# Altium project mmWave_PCB.PrjPcb (part 1 of 2)
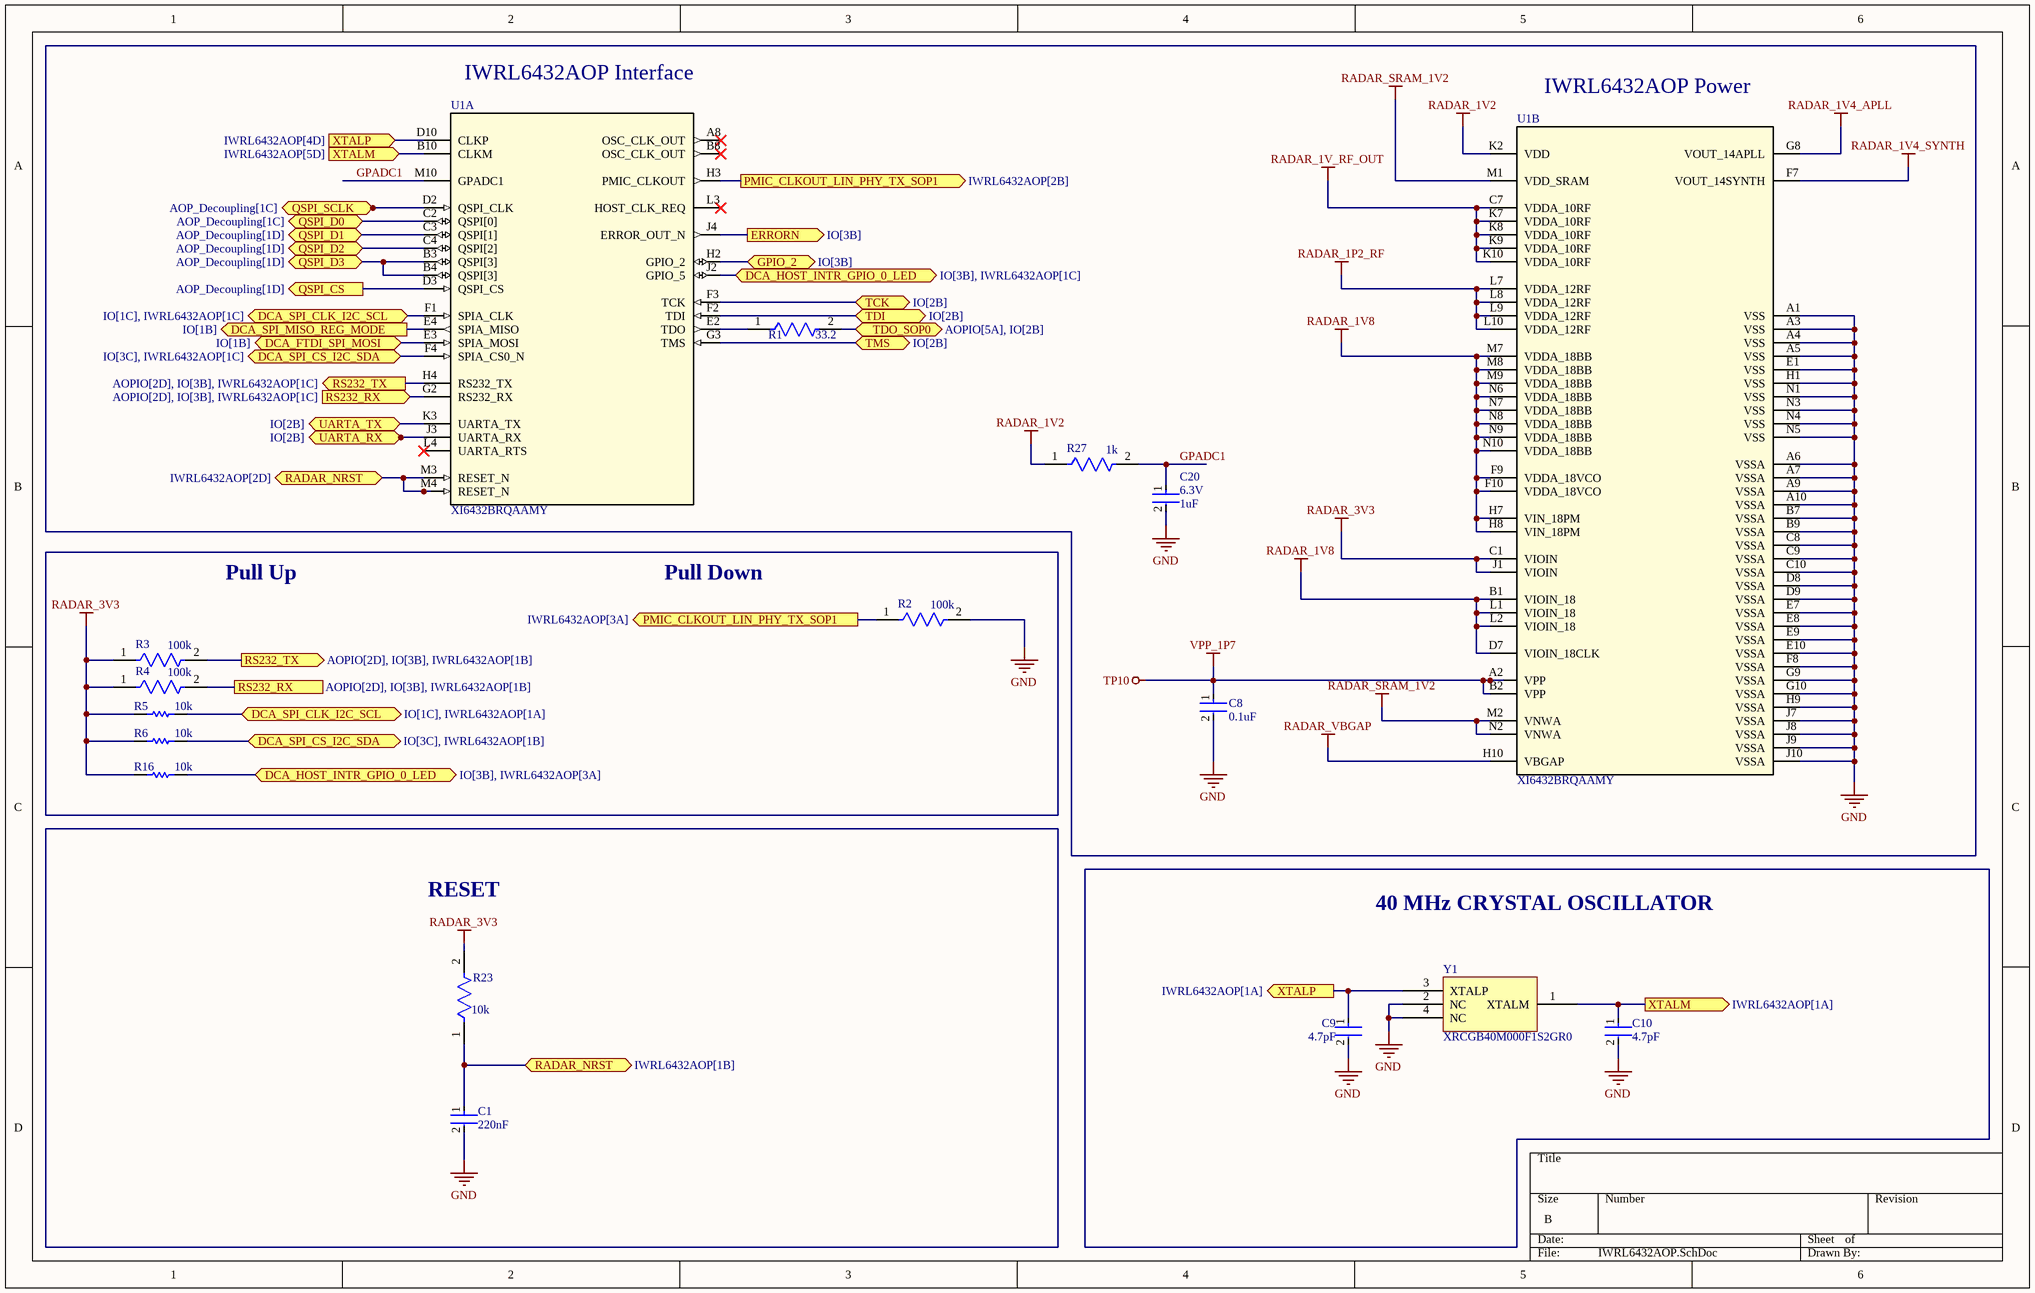
[diagram p0: IWRL6432AOP.SchDoc]
5 sheets, 112 parts. Net scope: flat (ports and power ports of the same name join across sheets).
Board file: AOP6432.PcbDoc
Sheets:
  IWRL6432AOP.SchDoc
  DC_Regulator.SchDoc
  AOP_Decoupling.SchDoc
  AOPIO.SchDoc
  IO.SchDoc

## Sheet IWRL6432AOP.SchDoc
size B; SheetNumber: 1; SheetTotal: 5

### Parts
C1  Capacitance: 220nF  [FP-CL549-IPC_C]  (hidden comment: CL05B224KO5NNNC)
C8  0.1uF  [FP-C0402-BB-MFG]
C9  Capacitance: 4.7pF  [FP-GJM155-0_05-IPC_C]  (hidden comment: GJM1555C1H4R7BB01D)
C10  Capacitance: 4.7pF  [FP-GJM155-0_05-IPC_C]  (hidden comment: GJM1555C1H4R7BB01D)
C20  Capacitance: 1uF  Voltage Rating (DC): 6.3V  [FP-GRM155-0_05-IPC_C]  (hidden comment: GRM155C80J105KA12D)
R1  Resistance: 33.2  [FP-RT0402-0_35-MFG]  (hidden comment: RT0402FRE0733R2L)
R2  Resistance: 100k  [FP-CRCW0402-C-e3-MFG]  (hidden comment: CRCW0402100KFKEDC)
R3  Resistance: 100k  [FP-CRCW0402-C-e3-MFG]  (hidden comment: CRCW0402100KFKEDC)
R4  Resistance: 100k  [FP-CRCW0402-C-e3-MFG]  (hidden comment: CRCW0402100KFKEDC)
R5  10k  [RESC1005X40X25LL05T10]
R6  10k  [RESC1005X40X25LL05T10]
R16  10k  [RESC1005X40X25LL05T10]
R23  Resistance: 10k  [FP-ERJ1R-MFG]  (hidden comment: ERJ-1RHD1002C)
R27  Resistance: 1k  [FP-RC0402-0_4-IPC_A]  (hidden comment: RC0402FR-071KL)
U1  XI6432BRQAAMY  [AMY0101A-MFG]  (parts A,B of 2)
Y1  XRCGB40M000F1S2GR0  [XRCGB40M000F1S2GR0]

### Ports
DCA_FTDI_SPI_MOSI (bidir, see IO[1B]), DCA_HOST_INTR_GPIO_0_LED (bidir, see IO[3B], IWRL6432AOP[1C]), DCA_HOST_INTR_GPIO_0_LED (bidir, see IO[3B], IWRL6432AOP[3A]), DCA_SPI_CLK_I2C_SCL (bidir, see IO[1C], IWRL6432AOP[1A]), DCA_SPI_CLK_I2C_SCL (bidir, see IO[1C], IWRL6432AOP[1C]), DCA_SPI_CS_I2C_SDA (bidir, see IO[3C], IWRL6432AOP[1B]), DCA_SPI_CS_I2C_SDA (bidir, see IO[3C], IWRL6432AOP[1C]), DCA_SPI_MISO_REG_MODE (out, see IO[1B]), ERRORN (out, see IO[3B]), GPIO_2 (bidir, see IO[3B]), PMIC_CLKOUT_LIN_PHY_TX_SOP1 (out, see IWRL6432AOP[2B]), PMIC_CLKOUT_LIN_PHY_TX_SOP1 (out, see IWRL6432AOP[3A]), QSPI_CS (out, see AOP_Decoupling[1D]), QSPI_D0 (bidir, see AOP_Decoupling[1C]), QSPI_D1 (bidir, see AOP_Decoupling[1D]), QSPI_D2 (bidir, see AOP_Decoupling[1D]), QSPI_D3 (bidir, see AOP_Decoupling[1D]), QSPI_SCLK (bidir, see AOP_Decoupling[1C]), RADAR_NRST (bidir, see IWRL6432AOP[1B]), RADAR_NRST (bidir, see IWRL6432AOP[2D]), RS232_RX (in, see AOPIO[2D], IO[3B], IWRL6432AOP[1C]), RS232_RX (see AOPIO[2D], IO[3B], IWRL6432AOP[1B]), RS232_TX (out, see AOPIO[2D], IO[3B], IWRL6432AOP[1B]), RS232_TX (out, see AOPIO[2D], IO[3B], IWRL6432AOP[1C]), TCK (bidir, see IO[2B]), TDI (bidir, see IO[2B]), TDO_SOP0 (bidir, see AOPIO[5A], IO[2B]), TMS (bidir, see IO[2B]), UARTA_RX (bidir, see IO[2B]), UARTA_TX (bidir, see IO[2B]), XTALM (in, see IWRL6432AOP[5D]), XTALM (out, see IWRL6432AOP[1A]), XTALP (in, see IWRL6432AOP[4D]), XTALP (out, see IWRL6432AOP[1A])

### Nets
GND: C1.2 C8.2 C9.2 C10.2 C20.2 R2.2 U1.A1(VSS) U1.A3(VSS) U1.A4(VSS) U1.A5(VSS) U1.A6(VSSA) U1.A7(VSSA) U1.A9(VSSA) U1.A10(VSSA) U1.B7(VSSA) U1.B9(VSSA) U1.C8(VSSA) U1.C9(VSSA) U1.C10(VSSA) U1.D8(VSSA) U1.D9(VSSA) U1.E1(VSS) U1.E7(VSSA) U1.E8(VSSA) U1.E9(VSSA) U1.E10(VSSA) U1.F8(VSSA) U1.G9(VSSA) U1.G10(VSSA) U1.H1(VSS) U1.H9(VSSA) U1.J7(VSSA) U1.J8(VSSA) U1.J9(VSSA) U1.J10(VSSA) U1.N1(VSS) U1.N3(VSS) U1.N4(VSS) U1.N5(VSS) Y1.2(NC) Y1.4(NC)
RADAR_1P2_RF: U1.L7(VDDA_12RF) U1.L8(VDDA_12RF) U1.L9(VDDA_12RF) U1.L10(VDDA_12RF)
RADAR_1V2: R27.1 U1.K2(VDD)
RADAR_1V4_APLL: U1.G8(VOUT_14APLL)
RADAR_1V4_SYNTH: U1.F7(VOUT_14SYNTH)
RADAR_1V8: U1.B1(VIOIN_18) U1.D7(VIOIN_18CLK) U1.F9(VDDA_18VCO) U1.F10(VDDA_18VCO) U1.H7(VIN_18PM) U1.H8(VIN_18PM) U1.L1(VIOIN_18) U1.L2(VIOIN_18) U1.M7(VDDA_18BB) U1.M8(VDDA_18BB) U1.M9(VDDA_18BB) U1.N6(VDDA_18BB) U1.N7(VDDA_18BB) U1.N8(VDDA_18BB) U1.N9(VDDA_18BB) U1.N10(VDDA_18BB)
RADAR_1V_RF_OUT: U1.C7(VDDA_10RF) U1.K7(VDDA_10RF) U1.K8(VDDA_10RF) U1.K9(VDDA_10RF) U1.K10(VDDA_10RF)
RADAR_3V3: R3.1 R4.1 R5.1 R6.1 R16.1 R23.2 U1.C1(VIOIN) U1.J1(VIOIN)  [project net FT230_VCCIO]
RADAR_SRAM_1V2: U1.M1(VDD_SRAM) U1.M2(VNWA) U1.N2(VNWA)
RADAR_VBGAP: U1.H10(VBGAP)
TP10: C8.1 U1.A2(VPP) U1.B2(VPP)  [also labelled VPP_1P7]
GPADC1: C20.1 R27.2 U1.M10(GPADC1)
NetC1_1: C1.1 R23.1 U1.M3(RESET_N) U1.M4(RESET_N) ; port RADAR_NRST
NetC9_1: C9.1 U1.D10(CLKP) Y1.3(XTALP) ; port XTALP
NetC10_1: C10.1 U1.B10(CLKM) Y1.1(XTALM) ; port XTALM
NetJ1_3: U1.F3(TCK) ; port TCK
NetJ1_5: U1.F2(TDI) ; port TDI
NetJ1_7: R1.2 ; port TDO_SOP0
NetJ1_8: R3.2 U1.H4(RS232_TX) ; port RS232_TX
NetJ1_10: R4.2 U1.G2(RS232_RX) ; port RS232_RX
NetJ1_11: U1.K3(UARTA_TX) ; port UARTA_TX
NetJ1_12: U1.J4(ERROR_OUT_N) ; port ERRORN
NetJ1_13: U1.J3(UARTA_RX) ; port UARTA_RX
NetJ1_15: U1.G3(TMS) ; port TMS
NetJ1_16: U1.H2(GPIO_2) ; port GPIO_2
NetJ1_18: R16.2 U1.J2(GPIO_5) ; port DCA_HOST_INTR_GPIO_0_LED
NetJ1_19: U1.E3(SPIA_MOSI) ; port DCA_FTDI_SPI_MOSI
NetJ1_21: U1.E4(SPIA_MISO) ; port DCA_SPI_MISO_REG_MODE
NetJ1_23: R5.2 U1.F1(SPIA_CLK) ; port DCA_SPI_CLK_I2C_SCL
NetJ1_24: R6.2 U1.F4(SPIA_CS0_N) ; port DCA_SPI_CS_I2C_SDA
NetR1_1: R1.1 U1.E2(TDO)
NetR2_1: R2.1 U1.H3(PMIC_CLKOUT) ; port PMIC_CLKOUT_LIN_PHY_TX_SOP1
NetR7_1: U1.D3(QSPI_CS) ; port QSPI_CS
NetR8_1: U1.B3(QSPI[3]) U1.B4(QSPI[3]) ; port QSPI_D3
NetR9_1: U1.C4(QSPI[2]) ; port QSPI_D2
NetR10_1: U1.D2(QSPI_CLK) ; port QSPI_SCLK
NetR11_1: U1.C2(QSPI[0]) ; port QSPI_D0
NetR12_1: U1.C3(QSPI[1]) ; port QSPI_D1

Not connected (* = marked no-connect by the designer): U1 A8(OSC_CLK_OUT)* B8(OSC_CLK_OUT)* L3(HOST_CLK_REQ)* L4(UARTA_RTS)*

### Notes on the sheet
- IWRL6432AOP Interface
- IWRL6432AOP Power
- Pull Up
- Pull Down
- RESET
- 40 MHz CRYSTAL OSCILLATOR

### Library data of the parts
C1 = CMP-13271-002972-1: Cap Ceramic 220nF 16V X7R ±10% SMD 0402 +125°C Paper T/R; Length: 1mm; Case Code (Metric): 1005; Dielectric: X7R; Thickness: 0.022inch; Packaging: Tape and Reel; Width: 0.02inch; Voltage Rating: 16V; Max Operating Temperature: 125°C; Tolerance: 10%; Depth: 0.5mm; Radiation Hardening: No; Case Code (Imperial): 0402; Height: 0.5mm; Package Quantity: 1; Mount: Surface Mount; Case/Package: 0402; Min Operating Temperature: -55°C
C8 = CMP-2008-03086-2: CAP CER 0.1UF 10V X7R 0402; Manufacturer Part Number: C0402C104K8RACTU; Manufacturer: Kemet; Capacitance: 0.10 μF; Tolerance: 0.1; Temperature Coefficient: 15%; Value: 0.10 μF; Material: Ceramic; Automotive: No; Temperature Range High: +125°C; Octopart: https://octopart.com/c0402c104k8ractu-kemet-106349; ComponentLink2Description: Datasheet; ComponentLink2URL: https://content.kemet.com/datasheets/KEM_C1002_X7R_SMD.pdf; Temperature: -55°C to +125°C; RoHS: TRUE; Temperature Range Low: -55°C; Temperature Characteristic: X7R; Lead Free: Yes; Height: 0.55mm; Voltage Rating: 10 V; Category: Cap; Device Class L3: Ceramic Capacitors; Digikey Description: CAP CER 0.1UF 10V X7R 0402; Package: C0402-BB; Device Class L1: Passive Components; Ipc Land Pattern Name: CAPC10050X50; Mouser Description: Multilayer Ceramic Capacitors MLCC - SMD/SMT 10volts 0.1uF X7R 10%; Device Class L2: Capacitors
C9 C10 = CMP-2008-03751-2: Multi-Layer Ceramic Capacitor 4.7pF C0G  ±0.1pF 0402 Paper T/R; Voltage Rating (DC): 50V; Max Operating Temperature: 125°C; Radiation Hardening: No; Thickness: 0.022inch; Depth: 0.5mm; Termination: SMD/SMT; Min Operating Temperature: -55°C; Case Code (Imperial): 0402; Voltage Rating: 50V; Dielectric: C0G; Length: 1mm; Package Quantity: 10000; Case/Package: 0402; Width: 0.5mm; Case Code (Metric): 1005; Packaging: Tape and Reel; Height: 0.5mm; Mount: Surface Mount
C20 = CMP-06035-011876-1: Chip Multilayer Ceramic Capacitors for General Purpose, 0402, 1.0uF, X6S, 22%, 10%, 6.3V; Dielectric: X6S; Width: 500um; Length: 1mm; Thickness: 500um; Tolerance: 10%
R1 = CMP-2002-03033-3: NexarPartId: 1272564; Max Power Dissipation: 63mW; Voltage Rating: 50V; Temperature Coefficient: 50ppm/°C; Tolerance: 1%; Packaging: Tape & Reel (TR); Radiation Hardening: No; Military Standard: Not; Contact Plating: Tin; Case Code (Metric): 0402; Max Operating Temperature: 125°C; Height: 350µm; Lead Free: Lead Free; Case/Package: 0402; Width: 508µm; Length: 990.6µm; RoHS: Compliant; Number of Terminations: 2; Voltage Rating (DC): 50V; Min Operating Temperature: -55°C; Power Rating: 63mW; Depth: 500µm; Composition: Thin Film
R2-R4 = CMP-02407-010951-1: RES 100K OHM 1% 1/16W 0402; Temperature Coefficient: 100ppm/°C; Power Rating: 62.5mW; Lead Free: Lead Free; Length: 1mm; Tolerance: 1%; Resistor Type: Thick Film; Contact Plating: Tin; Case/Package: SMD/SMT; Min Operating Temperature: -55°C; RoHS Compliant: Yes; Termination: Wraparound; Max Operating Temperature: 155°C; Mount: Surface Mount
R5 R6 R16 = CMP-2002-07353-1: Part Number: RC0402FR-0710KL; Manufacturer: Yageo / Phycomp
R23 = CMP-2004-03441-2: RES SMD 10K OHM 0.5% 1/20W 0201; Temperature Coefficient: 50ppm/°C; Voltage Rating: 15V; Max Power Dissipation: 50mW; Termination: SMD/SMT; Military Standard: Not; Depth: 0.3mm; Series: ERJ; Lead Free: Lead Free; Packaging: Tape and Reel; Package Quantity: 15000; Max Operating Temperature: 125°C; Width: 0.3mm; Tolerance: 0.5%; Case Code (Imperial): 0201; Length: 0.6mm; Min Operating Temperature: -55°C; Resistor Type: Thick Film; Height: 0.23mm; Mount: Surface Mount; Power Rating: 50mW; Case/Package: 0201; Case Code (Metric): 0603; Number of Terminations: 2
R27 = CMP-2002-07472-3: RES 1K OHM 1% 1/16W 0402; Max Power Dissipation: 63mW; Voltage Rating (DC): 50V; Temperature Coefficient: 100ppm/°C; Power Rating: 62.5mW; Technology: THICK FILM; Size Code: 0402; Series: RC; Length: 1mm; Case/Package: 0402; Features: Moisture Resistant; Termination: SMD/SMT; Case Code (Metric): 1005; Reach SVHC Compliant: Yes; Number of Terminations: 2; Tolerance: 1%; Lead Free: Lead Free; Military Standard: Not; Resistor Type: Thick Film; Max Operating Temperature: 155°C; RoHS Compliant: Yes; Construction: Rectangular; Voltage Rating: 50V; Packaging: Tape and Reel; Height: 0.32mm; Number of Pins: 2; Resistance Tolerance: 1%; Case Code (Imperial): 0402; Depth: 0.5mm; Min Operating Temperature: -55°C; Width: 0.5mm
U1 = XI6432BRQAAMY: Single-chip low-power 57GHz to 63.5GHz industrial mmWave radar sensor with integrated antenna 101-FCCSP -40 to 105; Manufacturer_Name: Texas Instruments; TYPE: TYPE; RefDes: RefDes; Copyright: Copyright (C) 2026 Ultra Librarian. All rights reserved.; Manufacturer_Part_Number: XI6432BRQAAMY
Y1 = XRCGB40M000F1S2GR0: Crystal, 40MHZ, 8PF, SMD, 2MM X 1.6MM;; Manufacturer: Murata; Supplier: DigiKey; Supplier Part Number: 490-XRCGB40M000F1S2GR0CT-ND; Manufacturer Part Number: XRCGB40M000F1S2GR0; Category: Crystals; Stock: 3900; Pricing: 1=0.31, 10=0.273, 25=0.2584, 50=0.2478, 100=0.2376, 250=0.22472, 500=0.21544, 1000=0.20652 (USD); ComponentLink1URL: http://sigma.octopart.com:80/reach_statement/Murata-company-16.pdf?src-supplier=Compliance+Statements; ComponentLink1Description: http://sigma.octopart.com:80/reach_statement/Murata-company-16.pdf?src-supplier=Compliance+Statements

## Sheet DC_Regulator.SchDoc
size B; SheetNumber: 2; SheetTotal: 5
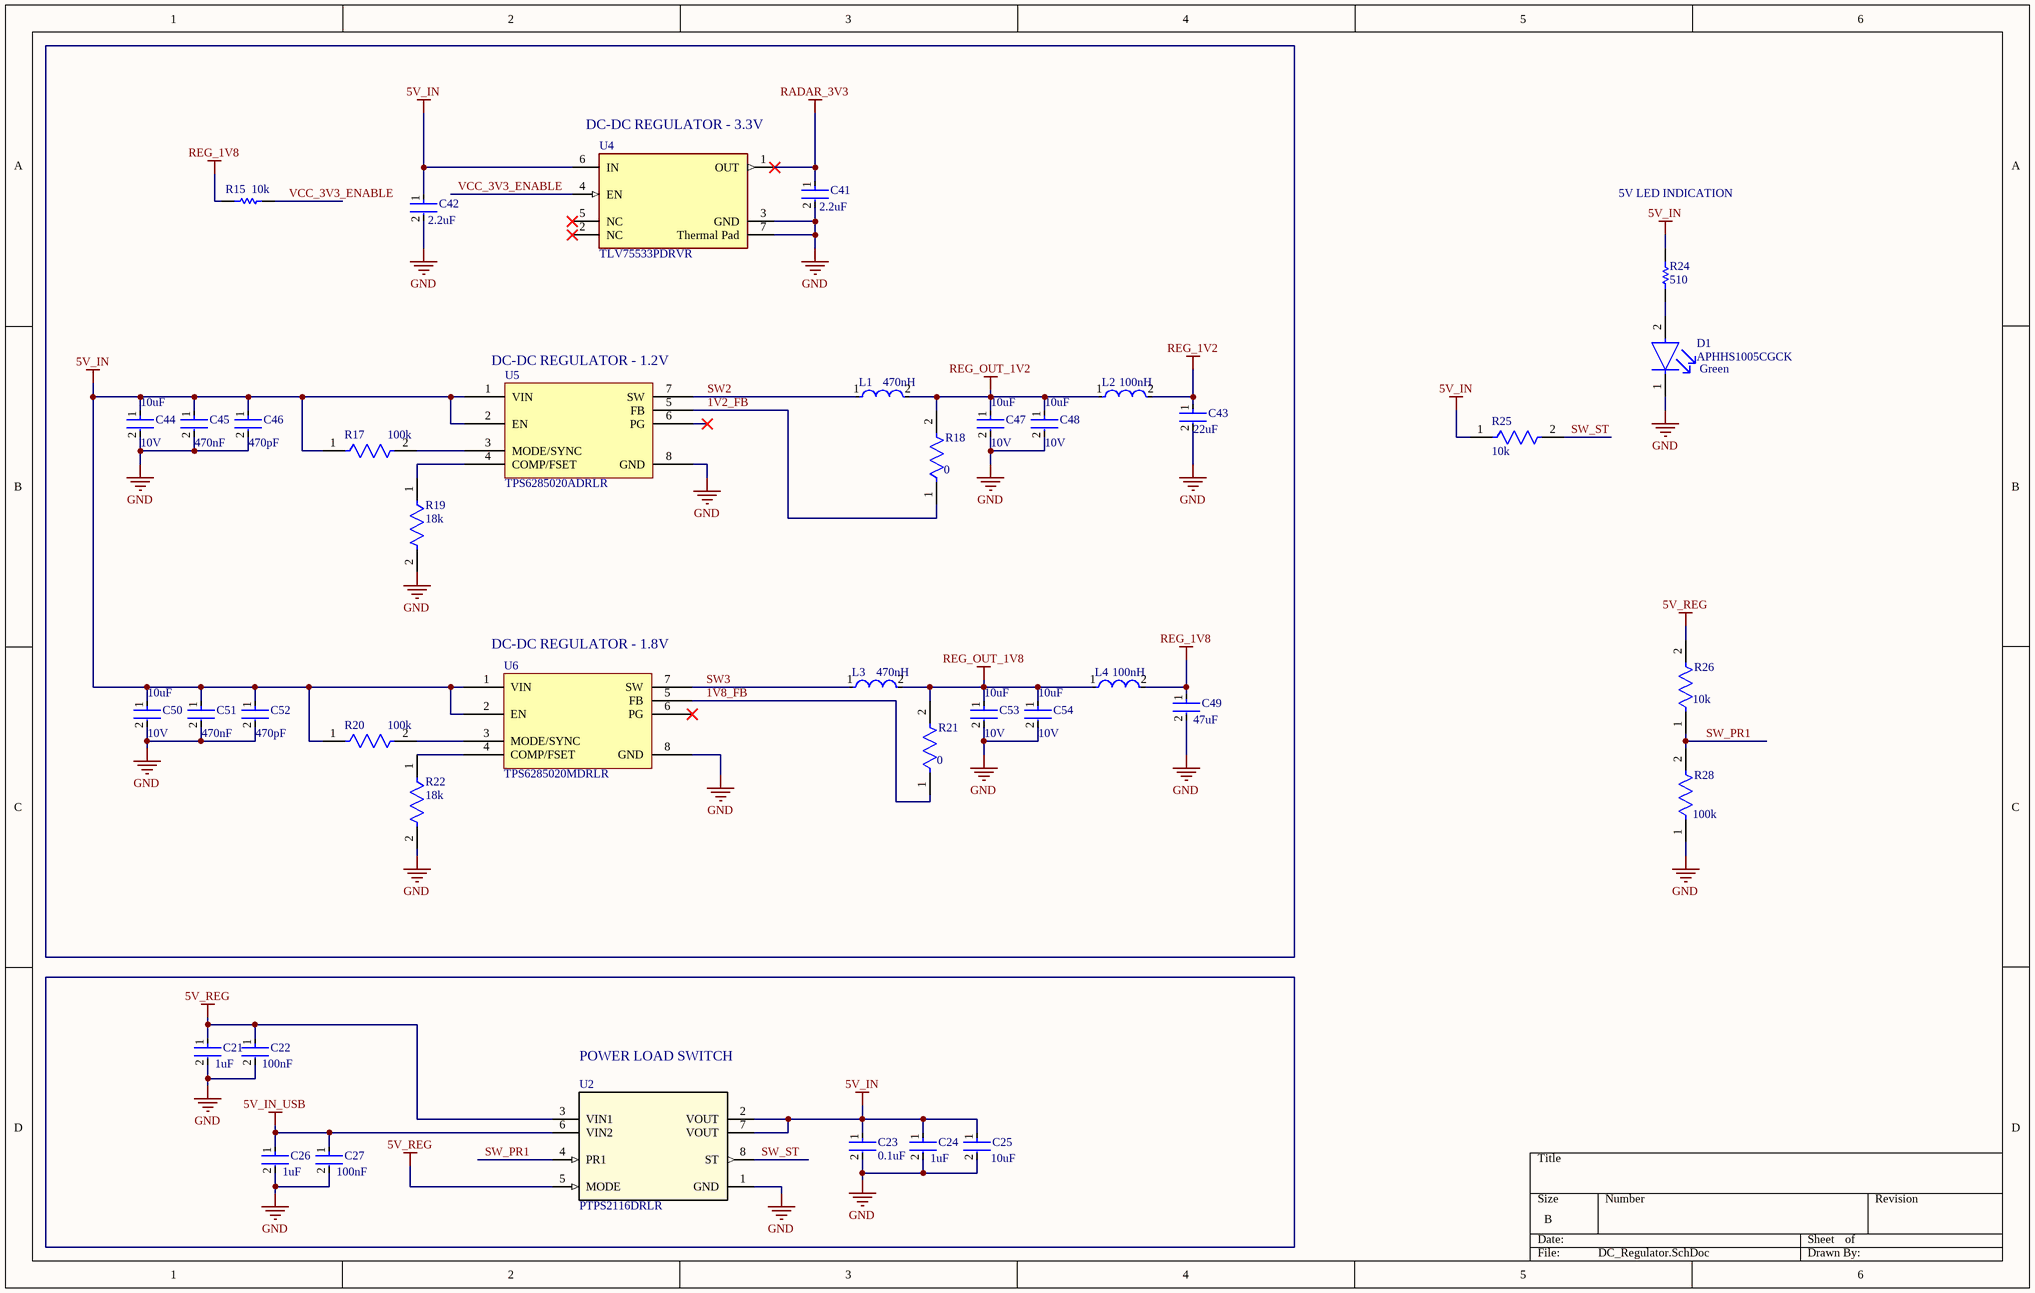
[diagram p1: DC_Regulator.SchDoc]

### Parts
C21  Capacitance: 1uF  [FP-GRT155-0_05-IPC_B]  (hidden comment: GRT155C81A105KE01D)
C22  Capacitance: 100nF  [FP-GCM155-0_05-IPC_A]  (hidden comment: GCM155R71H104KE02D)
C23  0.1uF  [FP-C0402-BB-MFG]
C24  Capacitance: 1uF  [FP-GRT155-0_05-IPC_B]  (hidden comment: GRT155C81A105KE01D)
C25  value 10uF  [FP-GRM188-0_2-IPC_B]  (hidden comment: GRM188Z71A106MA73D)
C26  Capacitance: 1uF  [FP-GRT155-0_05-IPC_B]  (hidden comment: GRT155C81A105KE01D)
C27  Capacitance: 100nF  [FP-GCM155-0_05-IPC_A]  (hidden comment: GCM155R71H104KE02D)
C41  Capacitance: 2.2uF  [FP-GRM155-0_2-MFG]  (hidden comment: GRM155C81C225KE11D)
C42  Capacitance: 2.2uF  [FP-GRM155-0_2-MFG]  (hidden comment: GRM155C81C225KE11D)
C43  Capacitance: 22uF  [FP-GRM31C-0_2-e0_3_0_8-MFG]  (hidden comment: GRM31CR70J226ME19K)
C44  Voltage Rating (DC): 10V  Capacitance: 10uF  [FP-GRM188-0_2-MFG]  (hidden comment: GRM188C81A106MA73D)
C45  Capacitance: 470nF  [FP-GRM188-0_1-e0_2_0_5-IPC_B]  (hidden comment: GRM188R71C474KA88D)
C46  Capacitance: 470pF  [FP-GRM155-0_05-IPC_A]  (hidden comment: GRM1555C1H471JA01D)
C47  Voltage Rating (DC): 10V  Capacitance: 10uF  [FP-GRM188-0_2-MFG]  (hidden comment: GRM188C81A106MA73D)
C48  Voltage Rating (DC): 10V  Capacitance: 10uF  [FP-GRM188-0_2-MFG]  (hidden comment: GRM188C81A106MA73D)
C49  Capacitance: 47uF  [FP-GRM31C-0_2-e0_3_0_8-IPC_C]  (hidden comment: GRM31CR60J476ME19L)
C50  Voltage Rating (DC): 10V  Capacitance: 10uF  [FP-GRM188-0_2-MFG]  (hidden comment: GRM188C81A106MA73D)
C51  Capacitance: 470nF  [FP-GRM188-0_1-e0_2_0_5-IPC_B]  (hidden comment: GRM188R71C474KA88D)
C52  Capacitance: 470pF  [FP-GRM155-0_05-IPC_A]  (hidden comment: GRM1555C1H471JA01D)
C53  Voltage Rating (DC): 10V  Capacitance: 10uF  [FP-GRM188-0_2-MFG]  (hidden comment: GRM188C81A106MA73D)
C54  Voltage Rating (DC): 10V  Capacitance: 10uF  [FP-GRM188-0_2-MFG]  (hidden comment: GRM188C81A106MA73D)
D1  APHHS1005CGCK  Illumination Color: Green  [FP-APHHS1005CGCK-MFG]
L1  470nH  [FP-DFE201210U-MFG]
L2  100nH  [FP-LQM2MPZ_JH-w2_4-MFG]
L3  470nH  [FP-DFE201210U-MFG]
L4  100nH  [FP-LQM2MPZ_JH-w2_4-MFG]
R15  10k  [RESC1005X40X25LL05T10]
R17  Resistance: 100k  [FP-CRCW0402-C-e3-MFG]  (hidden comment: CRCW0402100KFKEDC)
R18  Resistance: 0  [FP-RC0402-0_4-MFG]  (hidden comment: RC0402JR-070RP)
R19  Resistance: 18k  [FP-CRCW0402-e3-MFG]  (hidden comment: CRCW040218K0FKEDC)
R20  Resistance: 100k  [FP-CRCW0402-C-e3-MFG]  (hidden comment: CRCW0402100KFKEDC)
R21  Resistance: 0  [FP-RC0402-0_4-MFG]  (hidden comment: RC0402JR-070RP)
R22  Resistance: 18k  [FP-CRCW0402-e3-MFG]  (hidden comment: CRCW040218K0FKEDC)
R24  value 510  [RESC1005X40X25NL05T05]  (hidden comment: ERJ-2GEJ511X)
R25  Resistance: 10k  [FP-CRCW0402-C-e3-IPC_C]  (hidden comment: CRCW040210K0FKEDC)
R26  Resistance: 10k  [FP-CRCW0402-C-e3-IPC_C]  (hidden comment: CRCW040210K0FKEDC)
R28  Resistance: 100k  [FP-CRCW0402-e3-IPC_C]  (hidden comment: CRCW0402100KFKED)
U2  PTPS2116DRLR  [DRL0008A-MFG]
U4  TLV75533PDRVR  [FP-DRV0006A-IPC_A]
U5  TPS6285020ADRLR  [TPS6285020ADRLR]
U6  TPS6285020MDRLR  [TPS6285020MDRLR]

### Nets
5V_IN: C23.1 C24.1 C25.1 C42.1 C44.1 C45.1 C46.1 C50.1 C51.1 C52.1 R17.1 R20.1 R24.2 R25.1 U2.2(VOUT) U2.7(VOUT) U4.6(IN) U5.1(VIN) U5.2(EN) U6.1(VIN) U6.2(EN)
5V_IN_USB: C26.1 C27.1 U2.6(VIN2)  [project net FT230_VCC]
5V_REG: C21.1 C22.1 R26.2 U2.3(VIN1) U2.5(MODE)
GND: C21.2 C22.2 C23.2 C24.2 C25.2 C26.2 C27.2 C41.2 C42.2 C43.2 C44.2 C45.2 C46.2 C47.2 C48.2 C49.2 C50.2 C51.2 C52.2 C53.2 C54.2 D1.1(C) R19.2 R22.2 R28.1 U2.1(GND) U4.3(GND) U4.7(Thermal_Pad) U5.8(GND) U6.8(GND)
RADAR_3V3: C41.1 U4.1(OUT)  [project net FT230_VCCIO]
REG_1V2: C43.1 L2.2
REG_1V8: C49.1 L4.2 R15.1
REG_OUT_1V2: C47.1 C48.1 L1.2 L2.1 R18.2
REG_OUT_1V8: C53.1 C54.1 L3.2 L4.1 R21.2
1V2_FB: R18.1 U5.5(FB)
1V8_FB: R21.1 U6.5(FB)
SW2: L1.1 U5.7(SW)
SW3: L3.1 U6.7(SW)
SW_PR1: R26.1 R28.2 U2.4(PR1)
SW_ST: R25.2 U2.8(ST)
VCC_3V3_ENABLE: R15.2 U4.4(EN)
NetD1_2: D1.2(A) R24.1
NetR17_2: R17.2 U5.3(MODE/SYNC)
NetR19_1: R19.1 U5.4(COMP/FSET)
NetR20_2: R20.2 U6.3(MODE/SYNC)
NetR22_1: R22.1 U6.4(COMP/FSET)

Not connected (* = marked no-connect by the designer): U4 2(NC)* 5(NC)*; U5 6(PG)*; U6 6(PG)*

### Notes on the sheet
- (near U4) DC-DC REGULATOR - 3.3V
- 5V LED INDICATION
- (near U5) DC-DC REGULATOR - 1.2V
- (near U6) DC-DC REGULATOR - 1.8V
- POWER LOAD SWITCH

### Library data of the parts
C21 C24 C26 = CMP-06035-006530-1: Multi-Layer Ceramic Capacitor 1uF 10V X6S ±10% 0402 Paper T/R; Thickness: 0.022inch; Tolerance: 10%; Voltage Rating (DC): 10V; Length: 0.039inch; Width: 0.02inch; Max Operating Temperature: 105°C; Ratings: AEC-Q200; Dielectric: X6S; Min Operating Temperature: -55°C; Case/Package: 0402; Voltage Rating: 10V; Packaging: Tape and Reel; Case Code (Metric): 1005; Case Code (Imperial): 0402; Mount: Surface Mount
C22 C27 = CMP-2000-07456-3: Ceramic Capacitor for Automotive 100nF ±10% 50VDC X7R 0402 Paper T/R; Voltage Rating (DC): 50V; Package Quantity: 10000; Tolerance: 10%; Height: 0.5mm; Mount: Surface Mount; Voltage Rating: 50V; Weight: 0.000212oz; Thickness: 0.022inch; Case Code (Imperial): 0402; Length: 0.039inch; Packaging: Tape and Reel; Case Code (Metric): 1005; Min Operating Temperature: -55°C; Termination: SMD/SMT; REACH SVHC: No SVHC; Max Operating Temperature: 125°C; Lead Free: Lead Free; Dielectric: X7R; Ratings: AEC-Q200; Width: 0.5mm; Case/Package: 0402
C23 = CMP-2008-03086-2: as C8 on sheet IWRL6432AOP; Automotive: No; Temperature Range High: +125°C; Octopart: https://octopart.com/c0402c104k8ractu-kemet-106349; ComponentLink2Description: Datasheet; ComponentLink2URL: https://content.kemet.com/datasheets/KEM_C1002_X7R_SMD.pdf; Temperature: -55°C to +125°C; RoHS: TRUE; Temperature Range Low: -55°C; Temperature Characteristic: X7R; Lead Free: Yes; Height: 0.55mm; Voltage Rating: 10 V; Category: Cap; Device Class L3: Ceramic Capacitors; Digikey Description: CAP CER 0.1UF 10V X7R 0402; Package: C0402-BB; Device Class L1: Passive Components; Ipc Land Pattern Name: CAPC10050X50; Mouser Description: Multilayer Ceramic Capacitors MLCC - SMD/SMT 10volts 0.1uF X7R 10%; Device Class L2: Capacitors
C25 = CMP-06035-036920-1: Chip Multilayer Ceramic Capacitors for General Purpose, 0603, 10uF, X7R, 15%, 20%, 10V; Case/Package: 0603
C41 C42 = CMP-06035-059778-1: Chip Multilayer Ceramic Capacitors for General Purpose, 0402, 2.2uF, X6S, 22%, 10%, 16V; Material: Ceramic; Voltage Rating: 16V; Case/Package: 0402; Tolerance: 10%; Packaging: Tape and Reel; Mount: Surface Mount; Min Operating Temperature: -55°C; Height: 0.3mm; Thickness: 0.022inch; Voltage Rating (DC): 16V; Max Operating Temperature: 105°C; Length: 0.039inch; Width: 0.02inch
C43 = CMP-06035-034814-1: Chip Multilayer Ceramic Capacitors for General Purpose, 1206, 22uF, X7R, 15%, 20%, 6.3V; Packaging: Tape and Reel; Max Operating Temperature: 125°C; Min Operating Temperature: -55°C; Length: 0.126inch; Width: 0.063inch; Voltage Rating: 6.3V; Dielectric: X7R; Package Quantity: 6000; Tolerance: 20%; Weight: 0.001411oz; Mount: Surface Mount; Thickness: 0.071inch; Case/Package: 1206; Voltage Rating (DC): 6.3V
C44 C47 C48 C50 C53 C54 = CMP-06035-002932-1: Chip Multilayer Ceramic Capacitors for General Purpose, 0603, 10uF, X6S, 22%, 20%, 10V; Case Code (Metric): 1608; Max Operating Temperature: 105°C; Thickness: 0.031inch; Width: 0.031inch; Dielectric: X6S; Lead Free: Lead Free; REACH SVHC: No SVHC; Case/Package: 0603; Length: 0.063inch; Min Operating Temperature: -55°C; Package Quantity: 4000; Voltage Rating: 10V; Tolerance: 20%; Packaging: Cut Tape; Material: Ceramic; Mount: Surface Mount; Case Code (Imperial): 0603; Height: 0.8mm
C45 C51 = CMP-2006-02860-2: Chip Multilayer Ceramic Capacitors for General Purpose, 0603, 0.47uF, X7R, 15%, 10%, 16V; Material: Ceramic; Termination: SMD/SMT; Case Code (Imperial): 0603; Height: 0.8mm; Dielectric: X7R; Length: 1.6mm; Packaging: Tape and Reel; Mount: Surface Mount; Thickness: 0.035inch; Voltage Rating (DC): 16V; Case Code (Metric): 1608; REACH SVHC: No SVHC; Depth: 0.8mm; Number of Pins: 2; Max Operating Temperature: 125°C; Min Operating Temperature: -55°C; Width: 0.8mm; Voltage: 16V; Lead Free: Lead Free; Voltage Rating: 16V; Package Quantity: 1; Case/Package: 0603; Tolerance: 10%
C46 C52 = CMP-2008-04369-2: Chip Multilayer Ceramic Capacitors for General Purpose, 0402, 470pF, C0G, 30ppm/°C, 5%, 50V; Insulation Resistance: 10GR; Depth: 0.5mm; Voltage Rating: 50V; Packaging: Tape and Reel; Material: Ceramic; Lead Free: Lead Free; Max Operating Temperature: 125°C; Length: 1mm; Min Operating Temperature: -55°C; Height: 0.5mm; Width: 0.5mm; Thickness: 0.022inch; Voltage: 50V; Termination: SMD/SMT; Dielectric Material: Ceramic; REACH SVHC: No SVHC; Voltage Rating (DC): 50V; Package Quantity: 1; Dielectric: C0G; Radiation Hardening: No; Mount: Surface Mount; Case/Package: 0402; Number of Pins: 2; Tolerance: 5%; Temperature Coefficient: 30ppm/°C; Case Code (Metric): 1005; Case Code (Imperial): 0402
C49 = CMP-2000-06344-2: Chip Multilayer Ceramic Capacitors for General Purpose, 1206, 47uF, X5R, 15%, 20%, 6.3V; Package Quantity: 2000; Mount: Surface Mount; Length: 3.2mm; Thickness: 0.071inch; Lead Free: Lead Free; Tolerance: 20%; Width: 0.063inch; Depth: 1.6mm; Case/Package: 1206; Dielectric: X5R; Radiation Hardening: No; Packaging: Tape and Reel; Voltage Rating (DC): 6.3V; Termination: SMD/SMT; Height: 1.6mm; Max Operating Temperature: 85°C; Case Code (Metric): 3216; Case Code (Imperial): 1206; Voltage: 6.3V; Voltage Rating: 6.3V; Min Operating Temperature: -55°C; Material: Ceramic; REACH SVHC: No SVHC
D1 = CMP-44529-000044-1: LED GREEN CLEAR CHIP SMD; Viewing Angle: 120°; Dominant Wavelength: 570nm; Test Current: 20mA; Luminous Intensity: 50mcd; Forward Voltage: 2.1V; Number of LEDs: 1; Lens Color: Clear; Packaging: Tape and Reel; Max Operating Temperature: 85°C; Length: 1mm; Mount: Surface Mount; Lens Style: Clear; Color: Green; Number of Pins: 2; Wavelength: 570nm; Case/Package: 0402; Width: 0.5mm; Package Quantity: 2000; Case Code (Metric): 1005; Height: 0.6mm; Lead Free: Lead Free; Case Code (Imperial): 0402; Forward Current: 20mA; Min Operating Temperature: -40°C
L1 L3 = CMP-06042-016357-2: FIXED IND .47UH 3.0A 42MOHM
L2 L4 = CMP-06042-016732-1: FIXED IND 0.1UH 4000MA INFOTMT,; RoHS Compliant: Yes
R15 = CMP-2002-07353-1: as R5 on sheet IWRL6432AOP
R17 R20 = CMP-02407-010951-1: as R2 on sheet IWRL6432AOP; Lead Free: Lead Free; Length: 1mm; Tolerance: 1%; Resistor Type: Thick Film; Contact Plating: Tin; Case/Package: SMD/SMT; Min Operating Temperature: -55°C; RoHS Compliant: Yes; Termination: Wraparound; Max Operating Temperature: 155°C; Mount: Surface Mount
R18 R21 = CMP-03412-037830-1: RES SMD 0 OHM JUMPER 1/16W 0402; Max Power Dissipation: 63mW; Width: 0.02inch; Height: 0.016inch; Length: 0.039inch; Number of Terminations: 2; Max Operating Temperature: 155°C; Case Code (Metric): 1005; Resistor Type: Thick Film; RoHS Compliant: Yes; Packaging: Tape and Reel; Min Operating Temperature: -55°C; Case/Package: 0402; Features: Moisture Resistant; Case Code (Imperial): 0402
R19 R22 = CMP-02407-012458-1: RES 18K OHM 1% 1/16W 0402; Power Rating: 63mW; RoHS Compliant: Yes; Case/Package: 0402; Lead Free: Lead Free; Tolerance: 1%
R24 = CMP-2002-00551-1: Manufacturer: Panasonic; Part Number: ERJ-2GEJ511X
R25 R26 = CMP-02407-012085-1: RES 10K OHM 1% 1/16W 0402; Temperature Coefficient: 100ppm/°C; Power Rating: 62.5mW; Lead Free: Lead Free; Max Operating Temperature: 155°C; RoHS Compliant: Yes; Mount: Surface Mount; Min Operating Temperature: -55°C; Termination: Wraparound; Length: 1mm; Resistor Type: Thick Film; Contact Plating: Tin; Tolerance: 1%; Case/Package: Molded
R28 = CMP-2002-08123-3: RES Thick Film, 100kΩ, 1%, 0.063W, 100ppm/°C, 0402; Power Rating: 63mW; Voltage Rating (DC): 50V; Lead Free: Lead Free; Height: 0.35mm; Contact Plating: Tin; Min Operating Temperature: -55°C; Package Quantity: 10000; Case/Package: 0402; Temperature Coefficient: 100ppm/°C; Number of Terminations: 2; Packaging: Tape and Reel; Max Power Dissipation: 63mW; Case Code (Metric): 1005; Mount: Surface Mount; Width: 0.02inch; Termination: SMD/SMT; Length: 1mm; Number of Pins: 2; Weight: 2.3E-05oz; Radiation Hardening: No; Tolerance: 1%; Military Standard: Not; Features: Automotive AEC-Q200; Depth: 0.5mm; Composition: Thick Film; Max Operating Temperature: 155°C; Voltage Rating: 50V; Case Code (Imperial): 0402
U2 = PTPS2116DRLR: 1.6-V to 5.5-V, 40-mâ„¦, 2.5-A, low-IQ, priority power multiplexer ; 8-SOT-5X3 -40 to 125; Manufacturer_Name: Texas Instruments; TYPE: TYPE; RefDes: RefDes; Copyright: Copyright (C) 2025 Ultra Librarian. All rights reserved.; Manufacturer_Part_Number: PTPS2116DRLR
U4 = CMP-04917-000199-1: IC REG LINEAR 3.3V 500MA 6WSON; Number of Regulators: 1; Output Type: Fixed; Max Input Voltage: 5.5V; Dropout Voltage: 238mV; Quiescent Current: 31uA; Output Configuration: Positive; Power Supply Rejection Ratio (PSRR): 52dB; Max Output Voltage: 3.3V; Output Current: 500mA; Min Output Voltage: 3.3V; Packaging: Tape and Reel; Min Operating Temperature: -40°C; Mount: Surface Mount; RoHS Compliant: Yes; Max Operating Temperature: 125°C
U5 = TPS6285020ADRLR: 2.7-V to 6-V, 2-A, adjustable-frequency, step-down converter in SOT583 package 8-SOT-5X3 -40 to 150; Manufacturer: Texas Instruments; Manufacturer Lifecycle Status: ACTIVE; Topology: Buck; Supplier: DigiKey; Supplier Part Number: 296-TPS6285020ADRLRCT-ND; Manufacturer Part Number: TPS6285020ADRLR; RoHS: Compliant; Category: Voltage Regulators - Switching; Stock: 3967; Pricing: 1=1.52, 10=1.11, 25=1.0072, 100=0.8944, 250=0.8406, 500=0.80822, 1000=0.78154 (USD); Height: 0m; Length: 2.1mm; Lifecycle Status: Production; Pins: 8; Thickness: 550µm; Width: 1.2mm; ComponentLink1URL: https://sigma.octopart.com:443/184160452/technical_drawing/Texas-Instruments-TPS6285020ADRLR.pdf?src-supplier=Texas+Instruments; ComponentLink1Description: https://sigma.octopart.com:443/184160452/technical_drawing/Texas-Instruments-TPS6285020ADRLR.pdf?src-supplier=Texas+Instruments; ComponentLink2URL: https://octopart.com:443/opatz8j6/c1?t=04P0fWGL_cudllwmZINDiw2LV0UnQCBdEPC0TCiqtskBizWNZcYiud0zDodHV72PkfVAyckZwdOCP8RKkn6kOfyc1n5ayLeA0HxSBWJegEPGSGLcx5ZDwSrrVBBZMisL5iy0W6ZDyev6DYemWZv0TF3G9z2uzb8IyCt9JtlxFA4Kz3ep-HVrOA020RUMv0sDaqoO5QXkreUu2MZnPzpZ92hCZ4nlw88inlc1y5NUq3fymrAhanz4vne6D2PwE_A-BqCeNi6ywDWj7Zh3gVnmYHWucFLezg1APRGL1y_LI3b9EYi3y23IDx847xhIzfpELOnbBqVJCU5eR59dsCpX5dCCqJQSO7fhMA-LdTBewxpk-7SPURUjvrKQ9fgVnwgpJBWZzZVV-DQ&src-supplier=Texas+Instruments; ComponentLink2Description: https://octopart.com:443/opatz8j6/c1?t=04P0fWGL_cudllwmZINDiw2LV0UnQCBdEPC0TCiqtskBizWNZcYiud0zDodHV72PkfVAyckZwdOCP8RKkn6kOfyc1n5ayLeA0HxSBWJegEPGSGLcx5ZDwSrrVBBZMisL5iy0W6ZDyev6DYemWZv0TF3G9z2uzb8IyCt9JtlxFA4Kz3ep-HVrOA020RUMv0sDaqoO5QXkreUu2MZnPzpZ92hCZ4nlw88inlc1y5NUq3fymrAhanz4vne6D2PwE_A-BqCeNi6ywDWj7Zh3gVnmYHWucFLezg1APRGL1y_LI3b9EYi3y23IDx847xhIzfpELOnbBqVJCU5eR59dsCpX5dCCqJQSO7fhMA-LdTBewxpk-7SPURUjvrKQ9fgVnwgpJBWZzZVV-DQ&src-supplier=Texas+Instruments; ComponentLink3URL: https://sigma.octopart.com:443/182665545/technical_drawing/Texas-Instruments-TPS6285020ADRLR.pdf?src-supplier=Texas+Instruments; ComponentLink3Description: https://sigma.octopart.com:443/182665545/technical_drawing/Texas-Instruments-TPS6285020ADRLR.pdf?src-supplier=Texas+Instruments; ComponentLink4URL: https://sigma.octopart.com:443/158891806/technical_drawing/Texas-Instruments-TPS6285020ADRLR.pdf?src-supplier=Texas+Instruments; ComponentLink4Description: https://sigma.octopart.com:443/158891806/technical_drawing/Texas-Instruments-TPS6285020ADRLR.pdf?src-supplier=Texas+Instruments; ComponentLink5URL: http://sigma.octopart.com:80/reach_statement/Texas-Instruments-company-64.pdf?src-supplier=Compliance+Statements; ComponentLink5Description: http://sigma.octopart.com:80/reach_statement/Texas-Instruments-company-64.pdf?src-supplier=Compliance+Statements; ComponentLink6URL: http://sigma.octopart.com:80/conflict_mineral_statement/Texas-Instruments-company-63.pdf?src-supplier=Compliance+Statements; ComponentLink6Description: http://sigma.octopart.com:80/conflict_mineral_statement/Texas-Instruments-company-63.pdf?src-supplier=Compliance+Statements
U6 = TPS6285020MDRLR: 2.7-V to 6-V, 2-A, adjustable-frequency, step-down converter in SOT583 package 8-SOT-5X3 -40 to 150; Manufacturer: Texas Instruments; Manufacturer Lifecycle Status: ACTIVE; Topology: Buck; Supplier: DigiKey; Supplier Part Number: 296-TPS6285020MDRLRCT-ND; Manufacturer Part Number: TPS6285020MDRLR; RoHS: Compliant; Category: Voltage Regulators - Switching; Stock: 2434; Pricing: 1=1.52, 10=1.11, 25=1.0072, 100=0.8944, 250=0.8406, 500=0.80822, 1000=0.78154 (USD); Height: 0m; Length: 2.1mm; Lifecycle Status: Production; Pins: 8; Thickness: 550µm; Width: 1.2mm; ComponentLink1URL: https://sigma.octopart.com:443/184160452/technical_drawing/Texas-Instruments-TPS6285020MDRLR.pdf?src-supplier=Texas+Instruments; ComponentLink1Description: https://sigma.octopart.com:443/184160452/technical_drawing/Texas-Instruments-TPS6285020MDRLR.pdf?src-supplier=Texas+Instruments; ComponentLink2URL: https://octopart.com:443/opatz8j6/c1?t=j3yBvK7Knh4WlWv-GCmcuFftOO46dSNwGQl-vghnWa4P5FbmLUGqZNdsGfaa2BRR46_Y1nzoe2qF8sMvCt876JOyEgPizEtcT2yvP1vZQytL7fg4rcnOrOugqRiKWn0286UeK7FulRXUg4pTSKccoaKiJwsZgYKIRxgW7j4fAHRZJY4lsJ0ZDv8xhLvzrIp2Pcb8cqxZC7ty7vl1hVH_WtJZr1qIj67qX8542lWXUQdjGQKeDgJuvlZqR-rHtLmJKlwkQEL8PBADkijrD9-u13OcaRMmMNay04XWwwbZoMmW1KE4hF6cOnWV_RA-QnpXjrLeXbxdYo-tweympHrjh5YqTTZaQriQ9CqmxVDrh805T_blsE6klgcM7lXPiTRjw5KW9wlzXuU&src-supplier=Texas+Instruments; ComponentLink2Description: https://octopart.com:443/opatz8j6/c1?t=j3yBvK7Knh4WlWv-GCmcuFftOO46dSNwGQl-vghnWa4P5FbmLUGqZNdsGfaa2BRR46_Y1nzoe2qF8sMvCt876JOyEgPizEtcT2yvP1vZQytL7fg4rcnOrOugqRiKWn0286UeK7FulRXUg4pTSKccoaKiJwsZgYKIRxgW7j4fAHRZJY4lsJ0ZDv8xhLvzrIp2Pcb8cqxZC7ty7vl1hVH_WtJZr1qIj67qX8542lWXUQdjGQKeDgJuvlZqR-rHtLmJKlwkQEL8PBADkijrD9-u13OcaRMmMNay04XWwwbZoMmW1KE4hF6cOnWV_RA-QnpXjrLeXbxdYo-tweympHrjh5YqTTZaQriQ9CqmxVDrh805T_blsE6klgcM7lXPiTRjw5KW9wlzXuU&src-supplier=Texas+Instruments; ComponentLink3URL: https://sigma.octopart.com:443/182665545/technical_drawing/Texas-Instruments-TPS6285020MDRLR.pdf?src-supplier=Texas+Instruments; ComponentLink3Description: https://sigma.octopart.com:443/182665545/technical_drawing/Texas-Instruments-TPS6285020MDRLR.pdf?src-supplier=Texas+Instruments; ComponentLink4URL: https://sigma.octopart.com:443/158891806/technical_drawing/Texas-Instruments-TPS6285020MDRLR.pdf?src-supplier=Texas+Instruments; ComponentLink4Description: https://sigma.octopart.com:443/158891806/technical_drawing/Texas-Instruments-TPS6285020MDRLR.pdf?src-supplier=Texas+Instruments; ComponentLink5URL: https://datasheet.octopart.com:443/TPS6285020MDRLR-Texas-Instruments-datasheet-190364767.pdf?src-supplier=LCSC; ComponentLink5Description: https://datasheet.octopart.com:443/TPS6285020MDRLR-Texas-Instruments-datasheet-190364767.pdf?src-supplier=LCSC; ComponentLink6URL: http://sigma.octopart.com:80/reach_statement/Texas-Instruments-company-64.pdf?src-supplier=Compliance+Statements; ComponentLink6Description: http://sigma.octopart.com:80/reach_statement/Texas-Instruments-company-64.pdf?src-supplier=Compliance+Statements; ComponentLink7URL: http://sigma.octopart.com:80/conflict_mineral_statement/Texas-Instruments-company-63.pdf?src-supplier=Compliance+Statements; ComponentLink7Description: http://sigma.octopart.com:80/conflict_mineral_statement/Texas-Instruments-company-63.pdf?src-supplier=Compliance+Statements

## Sheet AOP_Decoupling.SchDoc
size A; SheetNumber: 3; SheetTotal: 5
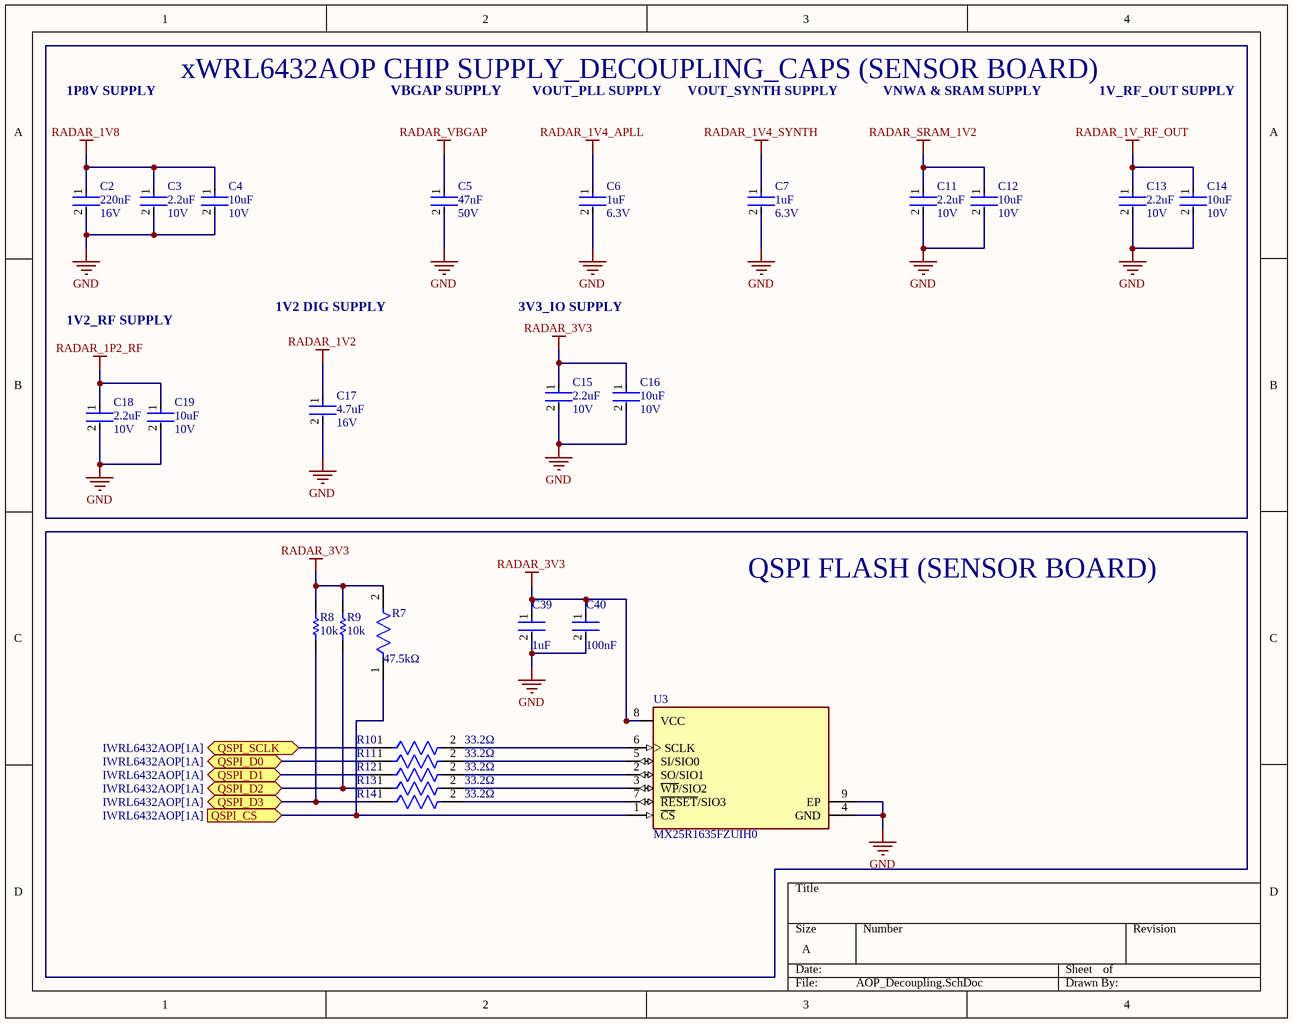
[diagram p2: AOP_Decoupling.SchDoc]

### Parts
C2  Capacitance: 220nF  Voltage: 16V  [FP-GRM155-0_05-IPC_C]  (hidden comment: GRM155R71C224KA12D)
C3  Capacitance: 2.2uF  Voltage: 10V  [FP-GRM155-0_05-IPC_A]  (hidden comment: GRM155R61A225ME01D)
C4  Voltage: 10V  Capacitance: 10uF  [FP-GRM188-0_2-IPC_B]  (hidden comment: GRM188Z71A106MA73D)
C5  Capacitance: 47nF  Voltage Rating (DC): 50V  [FP-C1005-050-0_05-IPC_C]  (hidden comment: C1005X7R1H473K050BB)
C6  Capacitance: 1uF  Voltage Rating: 6.3V  [FP-GRM155-0_05-MFG]  (hidden comment: GRM155R70J105KA12D)
C7  Capacitance: 1uF  Voltage Rating: 6.3V  [FP-GRM155-0_05-MFG]  (hidden comment: GRM155R70J105KA12D)
C11  Capacitance: 2.2uF  Voltage: 10V  [FP-GRM155-0_05-IPC_A]  (hidden comment: GRM155R61A225ME01D)
C12  Voltage: 10V  Capacitance: 10uF  [FP-GRM188-0_2-IPC_B]  (hidden comment: GRM188Z71A106MA73D)
C13  Capacitance: 2.2uF  Voltage: 10V  [FP-GRM155-0_05-IPC_A]  (hidden comment: GRM155R61A225ME01D)
C14  Voltage: 10V  Capacitance: 10uF  [FP-GRM188-0_2-IPC_B]  (hidden comment: GRM188Z71A106MA73D)
C15  Capacitance: 2.2uF  Voltage: 10V  [FP-GRM155-0_05-IPC_A]  (hidden comment: GRM155R61A225ME01D)
C16  Voltage: 10V  Capacitance: 10uF  [FP-GRM188-0_2-IPC_B]  (hidden comment: GRM188Z71A106MA73D)
C17  Voltage Rating (DC): 16V  Capacitance: 4.7uF  [FP-GCJ21B-0_3-IPC_C]  (hidden comment: GCJ21BR71C475KA01L)
C18  Capacitance: 2.2uF  Voltage: 10V  [FP-GRM155-0_05-IPC_A]  (hidden comment: GRM155R61A225ME01D)
C19  Voltage: 10V  Capacitance: 10uF  [FP-GRM188-0_2-IPC_B]  (hidden comment: GRM188Z71A106MA73D)
C39  Capacitance: 1uF  [FP-GRM155-0_05-IPC_C]  (hidden comment: GRM155C80J105KA12D)
C40  Capacitance: 100nF  [FP-C1005-050-IPC_C]  (hidden comment: C1005X7R1H104K050BE)
R7  Resistance: 47.5kΩ  [FP-RC0402-0_4-MFG]  (hidden comment: RC0402FR-1047K5L)
R8  10k  [RESC1005X40X25LL05T10]
R9  10k  [RESC1005X40X25LL05T10]
R10  Resistance: 33.2Ω  [FP-RT0402-0_35-MFG]  (hidden comment: RT0402FRE0733R2L)
R11  Resistance: 33.2Ω  [FP-RT0402-0_35-MFG]  (hidden comment: RT0402FRE0733R2L)
R12  Resistance: 33.2Ω  [FP-RT0402-0_35-MFG]  (hidden comment: RT0402FRE0733R2L)
R13  Resistance: 33.2Ω  [FP-RT0402-0_35-MFG]  (hidden comment: RT0402FRE0733R2L)
R14  Resistance: 33.2Ω  [FP-RT0402-0_35-MFG]  (hidden comment: RT0402FRE0733R2L)
U3  MX25R1635FZUIH0  [FP-USON-8-2x3mm-MFG]

### Ports
QSPI_CS (in, see IWRL6432AOP[1A]), QSPI_D0 (bidir, see IWRL6432AOP[1A]), QSPI_D1 (bidir, see IWRL6432AOP[1A]), QSPI_D2 (bidir, see IWRL6432AOP[1A]), QSPI_D3 (bidir, see IWRL6432AOP[1A]), QSPI_SCLK (bidir, see IWRL6432AOP[1A])

### Nets
GND: C2.2 C3.2 C4.2 C5.2 C6.2 C7.2 C11.2 C12.2 C13.2 C14.2 C15.2 C16.2 C17.2 C18.2 C19.2 C39.2 C40.2 U3.4(GND) U3.9(EP)
RADAR_1P2_RF: C18.1 C19.1
RADAR_1V2: C17.1
RADAR_1V4_APLL: C6.1
RADAR_1V4_SYNTH: C7.1
RADAR_1V8: C2.1 C3.1 C4.1
RADAR_1V_RF_OUT: C13.1 C14.1
RADAR_3V3: C15.1 C16.1 C39.1 C40.1 R7.2 R8.2 R9.2 U3.8(VCC)  [project net FT230_VCCIO]
RADAR_SRAM_1V2: C11.1 C12.1
RADAR_VBGAP: C5.1
NetR7_1: R7.1 U3.1(~{CS}) ; port QSPI_CS
NetR8_1: R8.1 R14.1 ; port QSPI_D3
NetR9_1: R9.1 R13.1 ; port QSPI_D2
NetR10_1: R10.1 ; port QSPI_SCLK
NetR10_2: R10.2 U3.6(SCLK)
NetR11_1: R11.1 ; port QSPI_D0
NetR11_2: R11.2 U3.5(SI/SIO0)
NetR12_1: R12.1 ; port QSPI_D1
NetR12_2: R12.2 U3.2(SO/SIO1)
NetR13_2: R13.2 U3.3(~{WP}/SIO2)
NetR14_2: R14.2 U3.7(~{RESET}/SIO3)

### Notes on the sheet
- 1P8V SUPPLY
- xWRL6432AOP CHIP SUPPLY_DECOUPLING_CAPS (SENSOR BOARD)
- VBGAP SUPPLY
- VOUT_PLL SUPPLY
- VOUT_SYNTH SUPPLY
- VNWA & SRAM SUPPLY
- 1V_RF_OUT SUPPLY
- 1V2_RF SUPPLY
- 1V2 DIG SUPPLY
- 3V3_IO SUPPLY
- QSPI FLASH (SENSOR BOARD)

### Library data of the parts
C2 = CMP-1034-02089-3: Chip Multilayer Ceramic Capacitors for General Purpose, 0402, 0.22uF, X7R, 15%, 10%, 16V; Depth: 0.5mm; Dielectric: X7R; Min Operating Temperature: -55°C; Package Quantity: 1; Termination: SMD/SMT; Mount: Surface Mount; Radiation Hardening: No; Height: 0.5mm; Case Code (Metric): 1005; Packaging: Tape and Reel; Material: Ceramic; Voltage Rating (DC): 16V; REACH SVHC: No SVHC; Voltage Rating: 16V; Length: 1mm; Tolerance: 10%; Thickness: 0.022inch; Case Code (Imperial): 0402; Max Operating Temperature: 125°C; Width: 0.02inch; Lead Free: Lead Free; Case/Package: 0402
C3 C11 C13 C15 C18 = CMP-06035-017182-1: Chip Multilayer Ceramic Capacitors for General Purpose, 0402, 2.2uF, X5R, 15%, 20%, 10V
C4 C12 C14 C16 C19 = CMP-06035-036920-1: as C25 on sheet DC_Regulator; Case/Package: 0603
C5 = CMP-2000-06006-2: Multilayer Ceramic Capacitors 47nF ±10% 50V X7R SMD 0402; Dissipation Factor: 5%; Weight: 2.3E-05oz; Max Operating Temperature: 125°C; Package Quantity: 1; Width: 0.02inch; Min Operating Temperature: -55°C; Length: 1mm; Dielectric: X7R; Voltage Rating: 50V; Number of Pins: 2; Lead Free: Lead Free; Voltage: 50V; Dielectric Material: Ceramic; Height: 0.5mm; Case Code (Metric): 1005; Construction: Flat; Termination: SMD/SMT; Case Code (Imperial): 0402; Depth: 0.5mm; Packaging: Tape and Reel; Mount: Surface Mount; Series: C; RoHS Compliant: Yes; Tolerance: 10%; Case/Package: 0402; Thickness: 0.022inch; Radiation Hardening: No; Resistor Type: Ceramic; REACH SVHC: No SVHC
C6 C7 = CMP-2008-04587-2: Chip Multilayer Ceramic Capacitors for General Purpose, 0402, 1.0uF, X7R, 15%, 10%, 6.3V; Case Code (Metric): 1005; Min Operating Temperature: -55°C; Tolerance: 10%; Depth: 0.5mm; Max Operating Temperature: 125°C; Width: 0.5mm; Case Code (Imperial): 0402; Termination: SMD/SMT; Weight: 0.000212oz; Thickness: 0.022inch; Package Quantity: 10000; Packaging: Tape and Reel; Lead Free: Lead Free; Height: 0.5mm; Length: 1mm; Dielectric: X7R; Case/Package: 0402; Voltage Rating (DC): 6.3V; Material: Ceramic; Mount: Surface Mount
C17 = CMP-06035-006740-1: Multilayer Ceramic Capacitors MLCC - SMD/SMT 0805 4.7uF 10%, 16VDC,  X7R 15%; Case Code (Imperial): 0805; Max Operating Temperature: 125°C; Package Quantity: 3000; Case/Package: 0805; Width: 1.25mm; Packaging: Tape and Reel; Length: 0.079inch; Dielectric: X7R; Ratings: AEC-Q200; Voltage Rating: 16V; Weight: 0.000335oz; Tolerance: 10%; Features: Soft Termination; Mount: Surface Mount; Termination: SMD/SMT; Thickness: 0.057inch; Height: 1.25mm; Case Code (Metric): 2012; Min Operating Temperature: -55°C; Lead Free: Lead Free
C39 = CMP-06035-011876-1: as C20 on sheet IWRL6432AOP; Dielectric: X6S; Width: 500um; Length: 1mm; Thickness: 500um; Tolerance: 10%; Voltage Rating (DC): 6.3V
C40 = CMP-08246-004330-1: CAP CER 0.1UF 50V X7R 0402; Tolerance: 10%; Max Operating Temperature: 125°C; Min Operating Temperature: -55°C; Width: 0.02inch; Case/Package: 0402; Case Code (Metric): 1005; Packaging: Tape and Reel; Length: 0.039inch; Features: Soft Termination; Thickness: 0.024inch; Voltage Rating: 50V; RoHS Compliant: Yes; Case Code (Imperial): 0402; Mount: Surface Mount
R7 = CMP-00621-30511908-1: RC0402FR-1047K5L General Purpose Chip Resistor Thick Film 0402 47.5kOhm 1% Paper T/R; RoHS: Non-Compliant; NexarPartId: 30511908; Packaging: Tape & Reel; Tolerance: 1%; Case/Package: 0402
R8 R9 = CMP-2002-07353-1: as R5 on sheet IWRL6432AOP
R10-R14 = CMP-2002-03033-3: as R1 on sheet IWRL6432AOP; Packaging: Tape & Reel (TR); Radiation Hardening: No; Military Standard: Not; Contact Plating: Tin; Case Code (Metric): 0402; Max Operating Temperature: 125°C; Height: 350µm; Lead Free: Lead Free; Case/Package: 0402; Width: 508µm; Length: 990.6µm; RoHS: Compliant; Number of Terminations: 2; Voltage Rating (DC): 50V; Min Operating Temperature: -55°C; Power Rating: 63mW; Depth: 500µm; Composition: Thin Film
U3 = CMP-105207-000004-1: IC FLASH 16M SPI 80MHZ 8USON; Packaging: Tape and Reel; Max Operating Temperature: 85°C; Memory Type: FLASH; Lead Free: Lead Free; Interface: SPI; Min Operating Temperature: -40°C; Frequency: 80MHz